# Altium schematic sheet FAN.SchDoc: Buck Sinc Converter
size A4; Organization: UDESC; Revision: R0; SheetNumber: 10; SheetTotal: 10
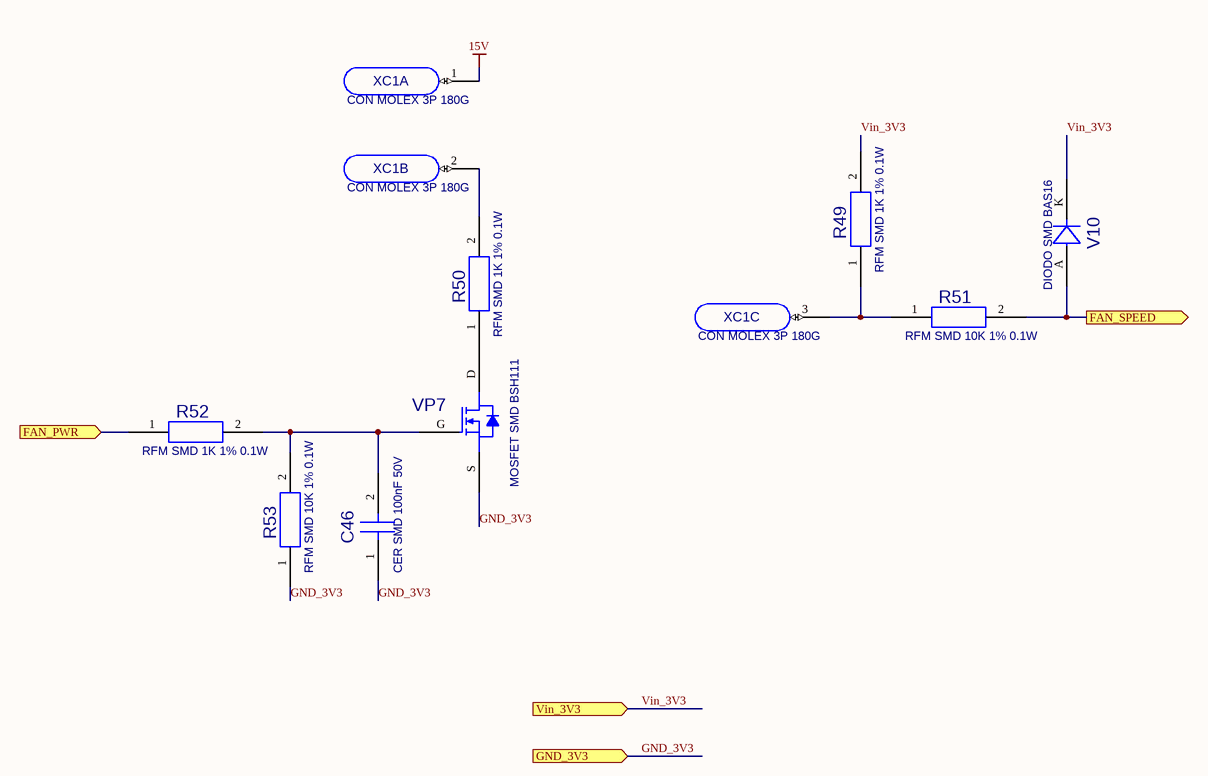
[diagram p0: FAN.SchDoc]

## Parts
C46  value CER SMD 100nF 50V  [C0805_R_V0]  (hidden comment: 10192075)
R49  value RFM SMD 1K 1% 0.1W  [R0805_R_V0]  (hidden comment: 10118077)
R50  value RFM SMD 1K 1% 0.1W  [R0805_R_V0]  (hidden comment: 10118077)
R51  value RFM SMD 10K 1% 0.1W  [R0805_R_V0]  (hidden comment: 10118076)
R52  value RFM SMD 1K 1% 0.1W  [R0805_R_V0]  (hidden comment: 10118077)
R53  value RFM SMD 10K 1% 0.1W  [R0805_R_V0]  (hidden comment: 10118076)
V10  value DIODO SMD BAS16  [SOT23A]  (hidden comment: 10261302)
VP7  value MOSFET SMD BSH111  [MOS_SOT23A]  (hidden comment: 11110327)
XC1  value CON MOLEX 3P 180G  [MOLEX 3P 180G M]  (hidden comment: 10190697)  (parts A,B,C of 3)

## Ports
FAN_PWR (in), FAN_SPEED (out), GND_3V3 (in), Vin_3V3 (in)

## Nets
15V: XC1.1(P1)
FAN_PWR: R52.1 ; port FAN_PWR
FAN_SPEED: R51.2 V10.A ; port FAN_SPEED
GND_3V3: C46.1 R53.1 VP7.S ; port GND_3V3
Vin_3V3: R49.2 V10.K ; port Vin_3V3
NetC46_2: C46.2 R52.2 R53.2 VP7.G
NetR49_1: R49.1 R51.1 XC1.3(P1)
NetR50_1: R50.1 VP7.D
NetR50_2: R50.2 XC1.2(P1)

Not connected (* = marked no-connect by the designer): V10 NC

## Notes on the sheet
- Title
- Size:
- Date:
- A4
- Number:
- Time:
- Revision:
- Sheet
- of
- File:

## Library data of the parts
C46 = 10192075: CER SMD 100nF 50V; HISsym: Atualizado em 12/07/05; TOL: 10%; ITEM BAAN: 0333.0044; PN: 10192075; PMT: SMD
R49 R50 R52 = 10118077: RFM SMD 1K 1% 0.1W; HISsym: Atualizado em 20/07/05; PN: 10118077; PMT: SMD
R51 R53 = 10118077: RFM SMD 10K 1% 0.1W; HISsym: Atualizado em 20/07/05; PN: 10118076; PMT: SMD
V10 = 10261302: DIODO SMD BAS16; HISsym: Atualizado em 17/04/06; VAL: 200mA; PN: 10261302; PMT: SMD
VP7 = 11110327: MOSFET SMD BSH111; HISsym: Atualizado em 12/09/05; HISitem: Criado em 20/12/07 (p/ Ricardo); PN: 11110327; PMT: SMD
XC1 = 10190697: CON MOLEX 3P 180G; HISsym: Atualizado em 06/07/05; NUMBER PIN: 03; PMT: THT; PN: 10190697; ComponenteLink1URL: *